# Altium project Metal Detector.PrjPcb
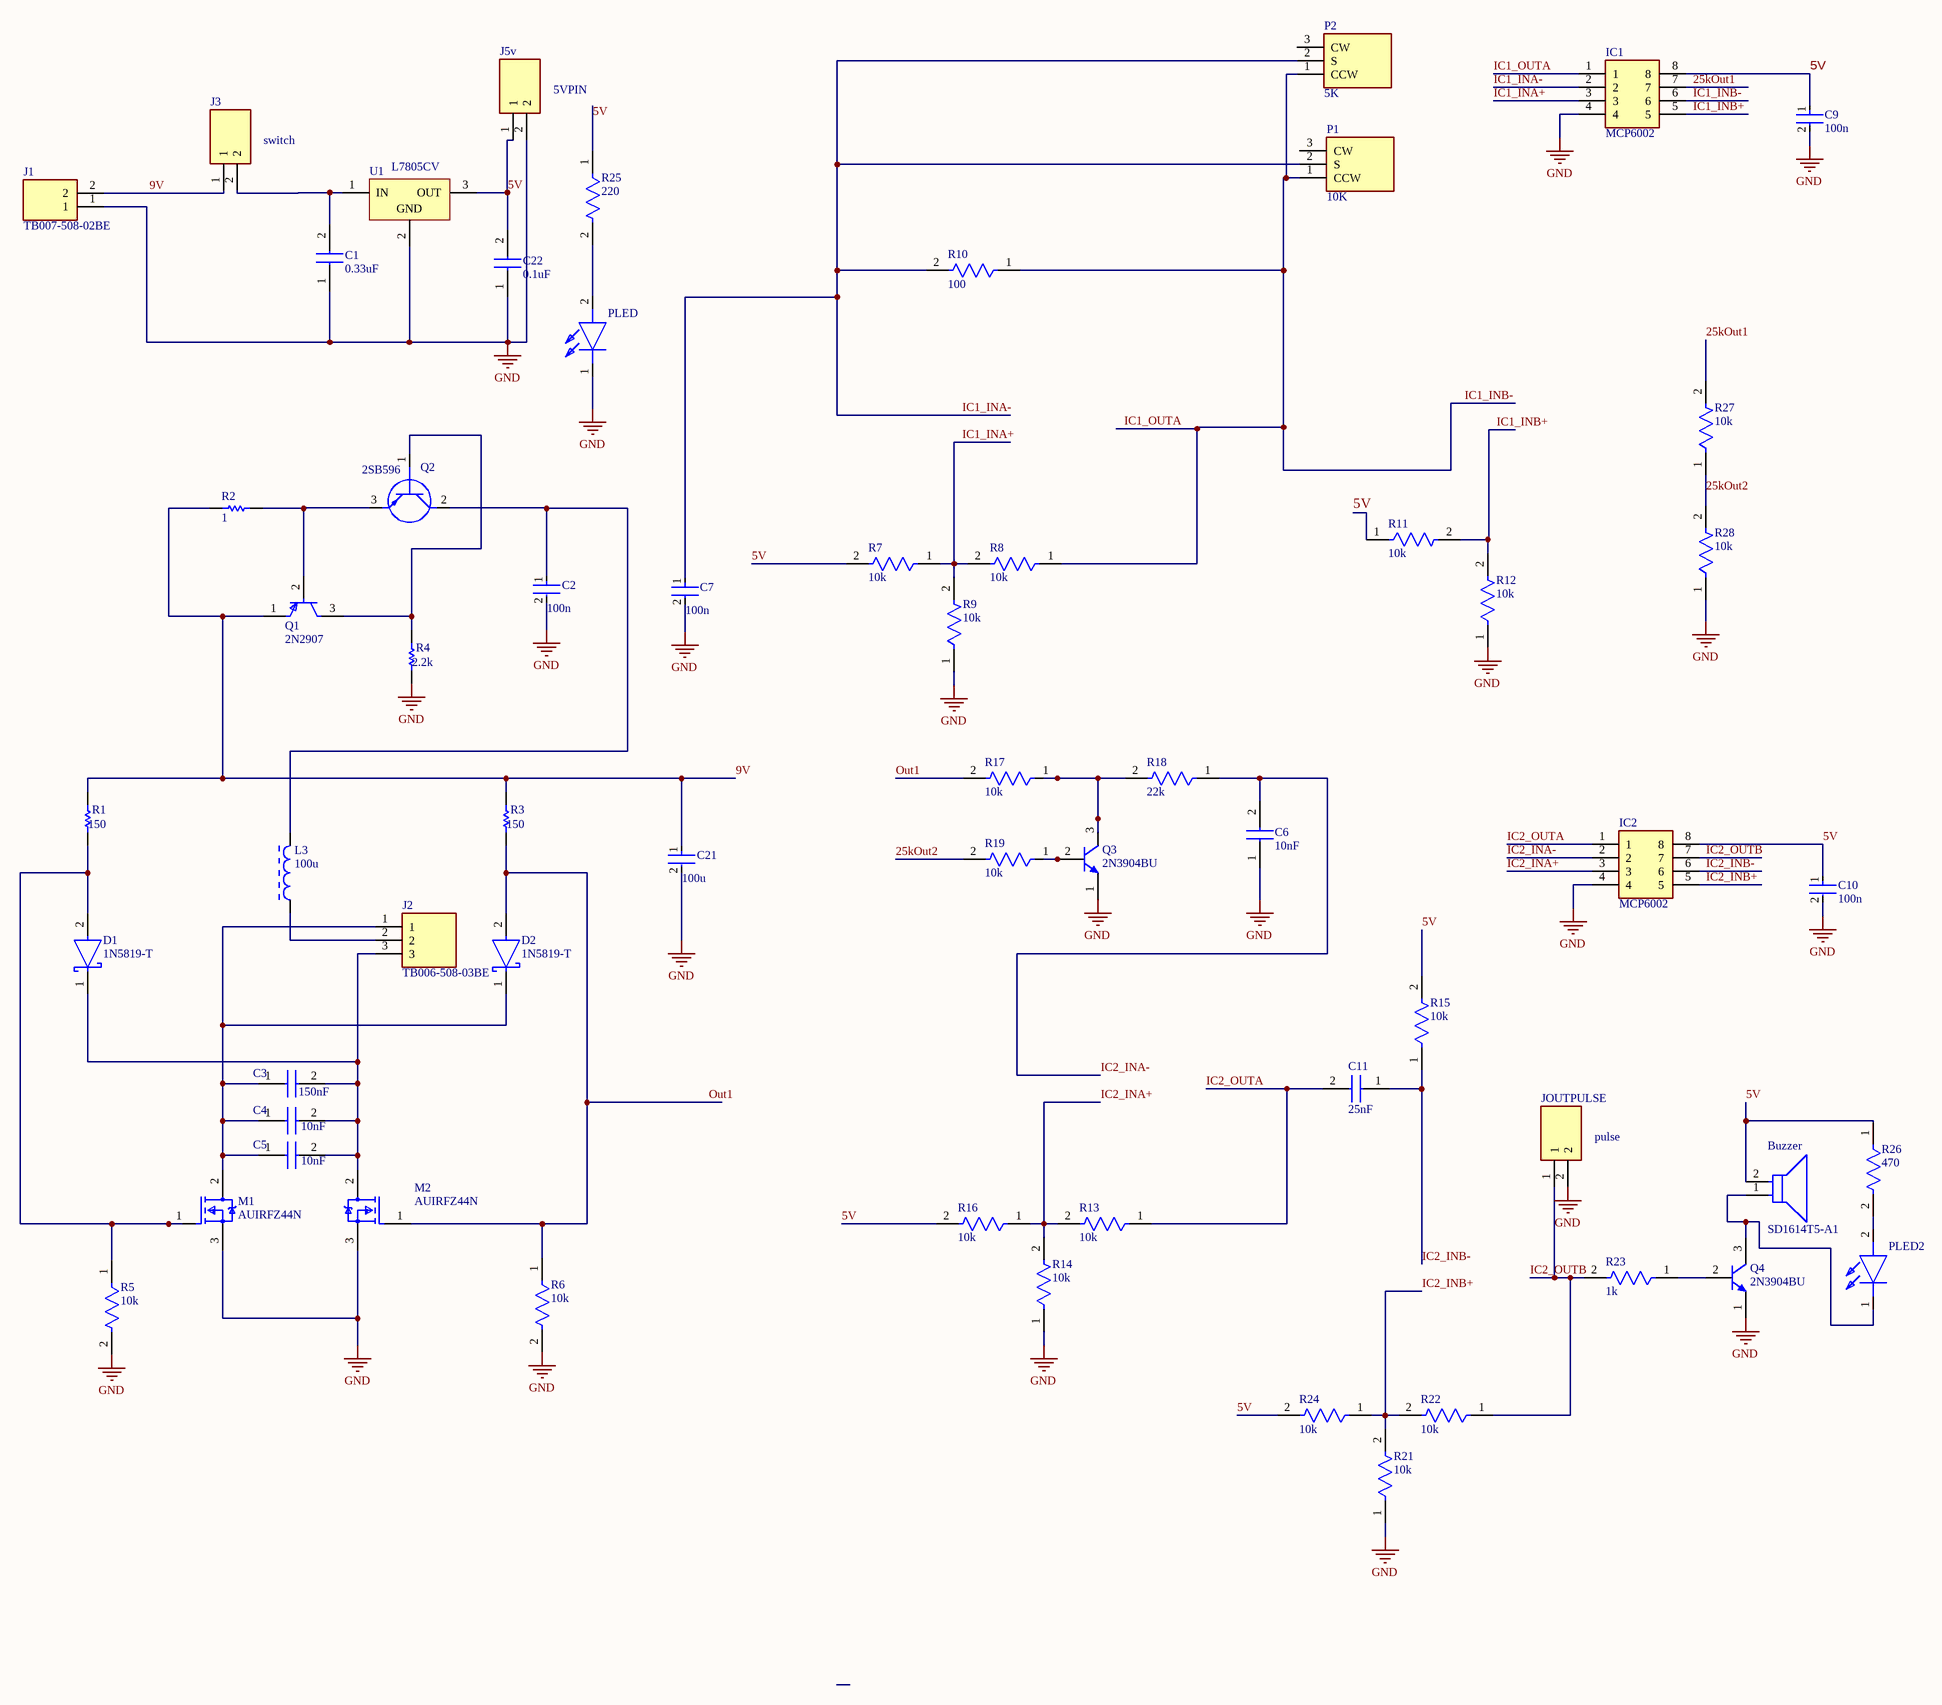
[diagram p0: Sheet1.SchDoc]
1 sheet, 61 parts. Net scope: global (net labels, ports and power ports of the same name join across sheets).
Board file: Metal Detector.PcbDoc

## Sheet Sheet1.SchDoc
size C portrait; SheetNumber: 1; SheetTotal: 1

### Parts
Buzzer  SD1614T5-A1  [FP-SD1614T5-A1-MFG]
C1  0.33uF  [C320C334M5U5TA7301]
C2  100n  [FP-RCE1K1-2_5-MFG]
C3  150nF  [RDER72J154K5E1H03A]
C4  10nF  [C315C103K5R5TA]
C5  10nF  [C315C103K5R5TA]
C6  10nF  [C315C103K5R5TA]
C7  100n  [FP-RCE1K1-2_5-MFG]
C9  100n  [FP-RCE1K1-2_5-MFG]
C10  100n  [FP-RCE1K1-2_5-MFG]
C11  25nF  [C315C103K5R5TA]
C21  100u  [FP-RCE1K1-2_5-MFG]
C22  0.1uF  [FK20]
D1  1N5819-T  [FP-DO-41_Plastic-MFG]
D2  1N5819-T  [FP-DO-41_Plastic-MFG]
IC1  MCP6002  [DIPS762W61P254L1016H525Q8N]
IC2  MCP6002  [DIPS762W61P254L1016H525Q8N]
J1  TB007-508-02BE  [TB00750802BE]
J2  TB006-508-03BE  [TB00650803BE]
J3  switch  [HDRV2W64P0X254_1X2_508X254X864P]
J5v  5VPIN  [HDRV2W64P0X254_1X2_508X254X864P]
JOUTPULSE  pulse  [HDRV2W64P0X254_1X2_508X254X864P]
L3  100u  [BOUR-77F-2_V1]
M1  AUIRFZ44N  [FP-TO-220AB-MFG]
M2  AUIRFZ44N  [FP-TO-220AB-MFG]
P1  10K  [P160KN0QC15B10K]
P2  5K  [P160KN0QC15B10K]
PLED  151051RS11000  [151051RS11000]  (value not drawn)
PLED2  151051RS11000  [151051RS11000]  (value not drawn)
Q1  2N2907  [FP-TO-18-MFG]
Q2  2SB596  [TO254P470X1016X2019-3P]
Q3  2N3904BU  [FAIR-TO-92]
Q4  2N3904BU  [FAIR-TO-92]
R1  150  [RESA60-630X240]
R2  1  [RESA60-630X240]
R3  150  [RESA60-630X240]
R4  2.2k  [RESA60-630X240]
R5  10k  [FP-CF18-MFG]
R6  10k  [FP-CF18-MFG]
R7  10k  [FP-CF18-MFG]
R8  10k  [FP-CF18-MFG]
R9  10k  [FP-CF18-MFG]
R10  100  [FP-CF18-MFG]
R11  10k  [FP-CF18-MFG]
R12  10k  [FP-CF18-MFG]
R13  10k  [FP-CF18-MFG]
R14  10k  [FP-CF18-MFG]
R15  10k  [FP-CF18-MFG]
R16  10k  [FP-CF18-MFG]
R17  10k  [FP-CF18-MFG]
R18  22k  [FP-CF18-MFG]
R19  10k  [FP-CF18-MFG]
R21  10k  [FP-CF18-MFG]
R22  10k  [FP-CF18-MFG]
R23  1k  [FP-CF18-MFG]
R24  10k  [FP-CF18-MFG]
R25  220  [FP-CF18-MFG]
R26  470  [FP-CF18-MFG]
R27  10k  [FP-CF18-MFG]
R28  10k  [FP-CF18-MFG]
U1  L7805CV  [TO220]

### Nets
GND: C1.1 C2.2 C6.1 C7.2 C9.2 C10.2 C21.2 C22.1 IC1.4 IC2.4 J1.1 J5v.2 JOUTPULSE.2 M1.3(S) M2.3(S) PLED.1(K) Q3.1(E) Q4.1(E) R4.1 R5.2 R6.2 R9.1 R12.1 R14.1 R21.1 R28.1 U1.2(GND)
5V: Buzzer.2(A) C9.1 C10.1 C22.2 IC1.8 IC2.8 J5v.1 R7.2 R11.1 R15.2 R16.2 R24.2 R25.1 R26.1 U1.3(OUT)
9V: C21.1 J1.2 J3.1 Q1.1(E) R1.2 R2.1 R3.2
25kOut1: IC1.7 R27.2
25kOut2: R19.2 R27.1 R28.2
IC1_INA+: IC1.3 R7.1 R8.2 R9.2
IC1_INA-: C7.1 IC1.2 P1.2(S) P2.2(S) R10.2
IC1_INB+: IC1.5 R11.2 R12.2
IC1_INB-: IC1.1 IC1.6 P1.1(CCW) P2.1(CCW) R8.1 R10.1  [also labelled IC1_OUTA]
IC2_INA+: IC2.3 R13.2 R14.2 R16.1
IC2_INA-: C6.2 IC2.2 R18.1
IC2_INB+: IC2.5 R21.2 R22.2 R24.1
IC2_INB-: C11.1 IC2.6 R15.1
IC2_OUTA: C11.2 IC2.1 R13.1
IC2_OUTB: IC2.7 JOUTPULSE.1 R22.1 R23.2
Out1: D2.2(A) M2.1(G) R3.1 R6.1 R17.2
NetBuzzer_1: Buzzer.1(C) PLED2.1(K) Q4.3(C)
NetC1_2: C1.2 J3.2 U1.1(IN)
NetC2_1: C2.1 L3.2 Q2.2(C)
NetC3_1: C3.1 C4.1 C5.1 D2.1(C) J2.1 M1.2(D)
NetC3_2: C3.2 C4.2 C5.2 D1.1(C) J2.3 M2.2(D)
NetD1_2: D1.2(A) M1.1(G) R1.1 R5.1
NetJ2_2: J2.2 L3.1
NetPLED2_2: PLED2.2(A) R26.2
NetPLED_2: PLED.2(A) R25.2
NetQ1_2: Q1.2(B) Q2.3(E) R2.2
NetQ1_3: Q1.3(C) Q2.1(B) R4.2
NetQ3_2: Q3.2(B) R19.1
NetQ3_3: Q3.3(C) R17.1 R18.2
NetQ4_2: Q4.2(B) R23.1

Not connected (* = marked no-connect by the designer): P1 3(CW); P2 3(CW)

### Library data of the parts
Buzzer = CMP-08413-000005-1: BUZZER MAGNETIC 5V 80DB 2048HZ 1; Frequency: 2.048kHz; Operating Supply Current: 80mA; Max Operating Temperature: 85°C; Min Operating Temperature: -40°C; Voltage Rating: 5V; Termination: PC Pins; Sensing Method: Magnetic; Mount: Panel
C1 = C320C334M5U5TA7301: Capacitor; Manufacturer_Name: KEMET; Datasheet Link: https://content.kemet.com/datasheets/KEM_C1051_GOLDMAX_Z5U.pdf; Height: 5.84mm; Manufacturer_Part_Number: C320C334M5U5TA7301; Mouser Part Number: 80-C320C334M5U5TATU; Mouser Price/Stock: https://www.mouser.co.uk/ProductDetail/KEMET/C320C334M5U5TA7301?qs=uD%2FdkN7XIa09BDaVzp0DSg%3D%3D
C2 C7 C9 C10 = CMP-06035-028865-1: Cap Ceramic Monolithic 100nF 100V 10% Thru-Hole Bulk; Dielectric: X7R; Lead Diameter: 0.5mm; Lead/Base Style: Formed Leads; Height: 3.5mm; Lead Free: Lead Free; Voltage Rating: 100V; Min Operating Temperature: -55°C; Ratings: AEC-Q200; Voltage Rating (DC): 100V; Termination: Radial; Packaging: Tape and Reel; Package Quantity: 2000; Width: 0.098inch; Case/Package: Radial; Height - Seated (Max): 0.138inch; Capacitance: 100nF; Max Operating Temperature: 125°C; Resistor Type: Ceramic; Lead Pitch: 0.197inch; Tolerance: 10%; Length: 0.157inch; Mount: Through Hole
C3 = RDER72J154K5E1H03A: Capacitor; Manufacturer_Name: Murata Electronics; Datasheet Link: https://search.murata.co.jp/Ceramy/image/img/A01X/G101/ENG/RDE_X7R_250V-1kV_E.pdf; Height: 4mm; Manufacturer_Part_Number: RDER72J154K5E1H03A; Mouser Part Number: 81-RDER72J154K5E1H3A; Mouser Price/Stock: https://www.mouser.co.uk/ProductDetail/Murata-Electronics/RDER72J154K5E1H03A?qs=hNud%2FORuBR3iiULarVQtcw%3D%3D; Arrow Part Number: RDER72J154K5E1H03A; Arrow Price/Stock: https://www.arrow.com/en/products/rder72j154k5e1h03a/murata-manufacturing
C4-C6 C11 = C315C103K5R5TA: Capacitor; Manufacturer_Name: KEMET; Datasheet Link: https://content.kemet.com/datasheets/KEM_C1050_GOLDMAX_X7R.pdf; Height: 4.66mm; Manufacturer_Part_Number: C315C103K5R5TA; Mouser Part Number: 80-C315C103K5R; Mouser Price/Stock: https://www.mouser.co.uk/ProductDetail/KEMET/C315C103K5R5TA?qs=73D%2FyAt1UYt79hsndjhLPg%3D%3D; Arrow Part Number: C315C103K5R5TA; Arrow Price/Stock: https://www.arrow.com/en/products/c315c103k5r5ta/kemet-corporation?utm_currency=USD&region=nac
C21 = CMP-06035-028865-1: Cap Ceramic Monolithic 100nF 100V 10% Thru-Hole Bulk; Dielectric: X7R; Lead Diameter: 0.5mm; Capacitance: 100uF; Lead/Base Style: Formed Leads; Height: 3.5mm; Lead Free: Lead Free; Voltage Rating: 100V; Min Operating Temperature: -55°C; Ratings: AEC-Q200; Voltage Rating (DC): 100V; Termination: Radial; Packaging: Tape and Reel; Package Quantity: 2000; Width: 0.098inch; Case/Package: Radial; Height - Seated (Max): 0.138inch; Max Operating Temperature: 125°C; Resistor Type: Ceramic; Lead Pitch: 0.197inch; Tolerance: 10%; Length: 0.157inch; Mount: Through Hole
C22 = FK20C0G1H104JN000: Capacitor; Manufacturer_Name: TDK; Datasheet Link: https://product.tdk.com/system/files/dam/doc/product/capacitor/ceramic/lead-mlcc/catalog/leadmlcc_conventional_fk_en.pdf; Height: 7mm; Manufacturer_Part_Number: FK20C0G1H104JN000
D1 D2 = CMP-12790-000042-1: DIODE SCHOTTKY 40V 1A DO41; Manufacturer: Diodes Inc.; Max Surge Forward Current: 25A; Capacitance: 110 pF; Max Junction Temp: +125°C; Peak Reverse Current: 1mA; Value: 110 pF; Temperature Range Low: -65°C; Footprint Url: https://www.diodes.com/assets/Package-Files/DO-41-Plastic.pdf; Digikey Description: DIODE SCHOTTKY 40V 1A DO41; Category: Diode; Mouser Description: Schottky Diodes & Rectifiers Vr/40V Io/1A T/R; Device Class L2: Diodes; Temperature Range High: +125°C; RoHS: TRUE; Device Class L3: Schottky Diodes; ComponentLink2Description: Datasheet; Temperature: -65°C to +125°C; Reverse Voltage: 40V; Height: 2.72mm; ComponentLink2URL: https://www.diodes.com/assets/Datasheets/ds23001.pdf; Forward Current: 1A; Manufacturer Part Number: 1N5819-T; Lead Free: Yes; Device Class L1: Discrete Semiconductors; Max Repetitive Reverse Voltage: 40V; Ipc Land Pattern Name: DIOPA1091W105L521D272; Automotive: No; Package: DO-41 (Plastic); Octopart: https://octopart.com/1n5819-t-diodes+inc.-55389586
IC1 IC2 = A_08-LC-TT: Connector; Manufacturer_Name: ASSMANN WSW components GmbH; Manufacturer_Part_Number: A 08-LC-TT; Datasheet Link: http://www.assmann-wsw.com/fileadmin/datasheets/ASS_0810_CO.pdf; Height: 5.25mm; Arrow Part Number: A 08-LC-TT; Arrow Price/Stock: https://www.arrow.com/en/products/a08-lc-tt/assmann-wsw-components-inc?region=nac
J1 = TB007-508-02BE: Connector; Manufacturer_Name: Same Sky; Datasheet Link: https://www.digikey.ph/en/products/detail/same-sky-formerly-cui-devices/TB007-508-02BE/10064127?msockid=3bdc366bbe0663d83c1223c0bf3662a6; Height: 14mm; Manufacturer_Part_Number: TB007-508-02BE; Mouser Part Number: 490-TB007-508-02BE; Mouser Price/Stock: https://www.mouser.co.uk/ProductDetail/Same-Sky/TB007-508-02BE?qs=vLWxofP3U2y6PFKAfCqKUQ%3D%3D; Arrow Part Number: TB007-508-02BE; Arrow Price/Stock: https://www.arrow.com/en/products/tb007-508-02be/cui-devices?utm_currency=USD&region=nac
J2 = TB006-508-03BE: Connector; Manufacturer_Name: Same Sky; Datasheet Link: https://www.sameskydevices.com/product/resource/supplyframepdf/tb006-508.pdf; Height: 10.4mm; Manufacturer_Part_Number: TB006-508-03BE; Mouser Part Number: 490-TB006-508-03BE; Mouser Price/Stock: https://www.mouser.co.uk/ProductDetail/Same-Sky/TB006-508-03BE?qs=vLWxofP3U2zmvvLYJBQLMA%3D%3D; Arrow Part Number: TB006-508-03BE; Arrow Price/Stock: https://www.arrow.com/en/products/tb006-508-03be/cui-devices?utm_currency=USD&region=nac
J3 J5v JOUTPULSE = M20-9990245: Connector; Manufacturer_Name: Harwin; Datasheet Link: https://cdn.harwin.com/pdfs/M20-999.pdf; Height: 8.64mm; Manufacturer_Part_Number: M20-9990245; Mouser Part Number: 855-M20-9990245; Mouser Price/Stock: https://www.mouser.co.uk/ProductDetail/Harwin/M20-9990245?qs=Jph8NoUxIfUDXEB%252Bi9kJRA%3D%3D
L3 = CMP-0732-00001-1: 77F Series Conformal Coated RF Choke, 470 uH +/- 5%, 126 mA, -55 to 105 degC, 3.99 mm Dia x 10.4 mm Length, RoHS, Tape and Reel; PartNumber: 77F471J-TR-RC; Manufacturer: Bourns; Inductance 100 kHz (Tol. %): 100 uH +/- 5; SRF Min.(MHz): 1.8; RDC Max.(Ohm): 8.5; Idc (mA): 126; Test Frequency (MHz): 0.796; Q Min.: 50; ComponentLink2Description: Datasheet; PackageReference: 77F-2; ComponentLink3Description: Package Specification; ComponentLink1URL: http://www.bourns.com/; ComponentLink2URL: http://www.bourns.com/data/global/pdfs/77F_series.pdf; Operating Temperature: -55 to 105 degC; Packing: Tape and Reel; PackageDescription: 2-Pin Through Hole RF Choke , Dia 3.99 mm, Length 10.4 mm; PackageVersion: Rev. 10/12; ComponentLink1Description: Manufacturer URL; ComponentLink3URL: http://www.bourns.com/data/global/pdfs/77F_series.pdf; RoHS: TRUE; DatasheetVersion: Rev. 10/12; Mounting Technology: Through Hole
M1 M2 = CMP-00196-65872631-1: AUIRFZ44N Automotive Q101 55V Single N-Channel HEXFET Power MOSFET in a TO-220AB Package, TO220-3, RoHS; Turn-On Delay Time: 7.3ns; Continuous Drain Current (ID): 49A; Max Power Dissipation: 94W; Fall Time: 60ns; On-State Resistance: 17.5mΩ; Number of Elements: 1; Turn-Off Delay Time: 44ns; Input Capacitance: 1.47nF; Threshold Voltage: 2V; Gate to Source Voltage (Vgs): 20V; Rise Time: 69ns; Max Junction Temperature (Tj): 175°C; Height: 16.51mm; Number of Pins: 3; Drain to Source Voltage (Vdss): 55V; Width: 4.82mm; Length: 10.66mm; NexarPartId: 65872631; REACH SVHC: No SVHC; Mount: Surface Mount, Through Hole; Contact Plating: Tin; Case/Package: TO-220AB; Package Quantity: 1000; Radiation Hardening: No; Power Dissipation: 94W; Element Configuration: Single; Schedule B: 8541290080, 8541290080; RoHS: Compliant; Lifecycle Status: Obsolete; Number of Channels: 1; Drain to Source Breakdown Voltage: 55V; Max Operating Temperature: 175°C; Rds On Max: 17.5mΩ; Drain to Source Resistance: 17.5mΩ; Min Operating Temperature: -55°C
P1 P2 = P160KN-0QC15B10K: Variable Resistor; Manufacturer_Name: TT Electronics; Datasheet Link: https://www.ttelectronics.com/TTElectronics/media/ProductFiles/Potentiometers/Datasheets/P160.pdf; Height: 16.5mm; Manufacturer_Part_Number: P160KN-0QC15B10K; Mouser Part Number: 858-P160KN-0QC15B10K; Mouser Price/Stock: https://www.mouser.co.uk/ProductDetail/BI-Technologies-TT-Electronics/P160KN-0QC15B10K?qs=%252BUYXD5bnyXowj%252Bd8P32cNw%3D%3D; Arrow Part Number: P160KN-0QC15B10K; Arrow Price/Stock: https://www.arrow.com/en/products/p160kn-0qc15b10k/bi-technologies
PLED PLED2 = 151051RS11000: LED; Manufacturer_Name: Wurth Elektronik; Datasheet Link: https://katalog.we-online.com/led/datasheet/151051RS11000.pdf; Height: 13.6mm; Manufacturer_Part_Number: 151051RS11000; Mouser Part Number: 710-151051RS11000; Mouser Price/Stock: https://www.mouser.co.uk/ProductDetail/Wurth-Elektronik/151051RS11000?qs=LlUlMxKIyB0NuMCRBgVmEg%3D%3D
Q1 = CMP-00252-117134470-1: 2N2907 Small-Signal Bjt To-18 Rohs Compliant: Yes; Power Dissipation: 500mW; Number of Elements: 1; Collector Emitter Saturation Voltage: 1.6V; Max Junction Temperature (Tj): 200°C; Collector Emitter Voltage (VCEO): 60V; Max Collector Current: 600mA; hFE Min: 100; Emitter Base Voltage (VEBO): 5V; Height: 5.33mm; Max Operating Temperature: 200°C; NexarPartId: 117134470; Case/Package: TO-18; Lifecycle Status: Production; Collector Base Voltage (VCBO): 60V; Collector Emitter Breakdown Voltage: 60V; Min Operating Temperature: -65°C
Q2 = TIP42C: Transistor BJT PNP; Manufacturer_Name: onsemi; Datasheet Link: http://www.mouser.com/ds/2/149/TIP42C-890174.pdf; Height: 4.7mm; Manufacturer_Part_Number: TIP42C; Mouser Part Number: 512-TIP42C; Mouser Price/Stock: https://www.mouser.co.uk/ProductDetail/onsemi-Fairchild/TIP42C?qs=cnIeywgme7b7B3r0xPyyBQ%3D%3D; Arrow Part Number: TIP42C; Arrow Price/Stock: https://www.arrow.com/en/products/tip42c/on-semiconductor
Q3 Q4 = CMP-2000-04944-1: NPN General-Purpose Amplifier, 40 V VCEO, 0.2 A, -55 to 150 degC, 2-Pin TO-92, RoHS, Bulk; Manufacturer: FairchildSemiconductor; Maximum Collector Base Voltage: 60V; Minimum DC Current Gain: 40@0.1mA@1V; Maximum Collector Emitter Voltage: 40V; Maximum DC Collector Current: 0.2A; Rad Hard: No; Maximum Operating Frequency: 300(Min)MHz; Maximum Collector Emitter Saturation Voltage: 0.2@1mA@10mA; Maximum Power Dissipation: 625mW; Package Description: 3-Pin Transistor Outline Package, Body Dia 4.79 mm, Pitch 1.27 mm; Package Reference: TO-92; Pin Count: 3; Operating Temperature: -55to150degC; Category: GPBJT; Manufacturer URL: https://www.fairchildsemi.com/; Datasheet URL: https://datasheet.ciiva.com/4722/2n3904-82270-4722369.pdf; Package: 3TO-92; Packaging: Bulk; Type: NPN; Datasheet Version: Rev. 1.1.0, 10/2014; Mounting: ThroughHole
R1 R3 = CMP-1659-00075-1: Axial Resistor, 1 KOhm, +/- 1%, 250 mW, -55 to 155 degC, 2-Pin THD, RoHS, Bulk; Voltage Rating: 250 V; Resistance: 150 ohm; Power Rating: 250 mW; ComponentLink2Description: Datasheet; RoHSCompliant: true; PackageReference: MFR-25; Case\Package: Axial; Max Operating Temperature: 155 degC; DatasheetVersion: Apr-13; Tolerance: 1%; ComponentLink1URL: http://www.yageo.com/; Length: 0.248 inch; ComponentLink2URL: http://www.yageo.com/documents/recent/Yageo%20LR_MFR_2013.pdf; Packaging: Bulk; Package Quantity: 200; PackageDescription: 2-Pin Axial Lead, Dia 2.4 mm, Body Length 6.3 mm; Min Operating Temperature: -55 degC; ComponentLink1Description: Manufacturer URL
R2 = CMP-1659-00075-1: Axial Resistor, 1 KOhm, +/- 1%, 250 mW, -55 to 155 degC, 2-Pin THD, RoHS, Bulk; Voltage Rating: 250 V; Resistance: 1 ohm; Power Rating: 250 mW; ComponentLink2Description: Datasheet; RoHSCompliant: true; PackageReference: MFR-25; Case\Package: Axial; Max Operating Temperature: 155 degC; DatasheetVersion: Apr-13; Tolerance: 1%; ComponentLink1URL: http://www.yageo.com/; Length: 0.248 inch; ComponentLink2URL: http://www.yageo.com/documents/recent/Yageo%20LR_MFR_2013.pdf; Packaging: Bulk; Package Quantity: 200; PackageDescription: 2-Pin Axial Lead, Dia 2.4 mm, Body Length 6.3 mm; Min Operating Temperature: -55 degC; ComponentLink1Description: Manufacturer URL
R4 = CMP-1659-00075-1: Axial Resistor, 1 KOhm, +/- 1%, 250 mW, -55 to 155 degC, 2-Pin THD, RoHS, Bulk; Voltage Rating: 250 V; Resistance: 2200 ohm; Power Rating: 250 mW; ComponentLink2Description: Datasheet; RoHSCompliant: true; PackageReference: MFR-25; Case\Package: Axial; Max Operating Temperature: 155 degC; DatasheetVersion: Apr-13; Tolerance: 1%; ComponentLink1URL: http://www.yageo.com/; Length: 0.248 inch; ComponentLink2URL: http://www.yageo.com/documents/recent/Yageo%20LR_MFR_2013.pdf; Packaging: Bulk; Package Quantity: 200; PackageDescription: 2-Pin Axial Lead, Dia 2.4 mm, Body Length 6.3 mm; Min Operating Temperature: -55 degC; ComponentLink1Description: Manufacturer URL
R5-R17 R19 R21 R22 R24 R25 R27 R28 = CMP-26528-000002-1: RES 10K OHM 1/8W 5% CF AXIAL; Manufacturer Part Number: CF18JT10K0; Manufacturer: Stackpole Electronics; Power Rating: 0.125W; Temperature Coefficient: 0-500ppm/°C; Resistance: 10kΩ; Voltage Rating: 250V; Value: 10kΩ; Temperature: -55°C to +155°C; Height: 2mm; Lead Free: Yes; Automotive: No; Device Class L2: Resistors; Package: CF18; Series: CF; ComponentLink2Description: Datasheet; Ipc Land Pattern Name: RESAD656W65L360D200; Temperature Range High: +155°C; RoHS: TRUE; Device Class L3: Through-Hole Resistors; Temperature Range Low: -55°C; Device Class L1: Passive Components; Category: Res; Octopart: https://octopart.com/cf18jt10k0-stackpole+electronics-19205642; Composition: Carbon Film; Digikey Description: RES 10K OHM 1/8W 5% CF AXIAL; ComponentLink2URL: http://www.seielect.com/Catalog/SEI-CF_CFM.pdf; Tolerance: 5%
R18 = CMP-26528-000002-1: RES 10K OHM 1/8W 5% CF AXIAL; Manufacturer Part Number: CF18JT10K0; Manufacturer: Stackpole Electronics; Power Rating: 0.125W; Temperature Coefficient: 0-500ppm/°C; Resistance: 22kΩ; Voltage Rating: 250V; Value: 22kΩ; Temperature: -55°C to +155°C; Height: 2mm; Lead Free: Yes; Automotive: No; Device Class L2: Resistors; Package: CF18; Series: CF; ComponentLink2Description: Datasheet; Ipc Land Pattern Name: RESAD656W65L360D200; Temperature Range High: +155°C; RoHS: TRUE; Device Class L3: Through-Hole Resistors; Temperature Range Low: -55°C; Device Class L1: Passive Components; Category: Res; Octopart: https://octopart.com/cf18jt10k0-stackpole+electronics-19205642; Composition: Carbon Film; Digikey Description: RES 10K OHM 1/8W 5% CF AXIAL; ComponentLink2URL: http://www.seielect.com/Catalog/SEI-CF_CFM.pdf; Tolerance: 5%
R23 R26 = CMP-26528-000002-1: RES 10K OHM 1/8W 5% CF AXIAL; Manufacturer Part Number: CF18JT10K0; Manufacturer: Stackpole Electronics; Power Rating: 0.125W; Temperature Coefficient: 0-500ppm/°C; Resistance: 1kΩ; Voltage Rating: 250V; Value: 1kΩ; Temperature: -55°C to +155°C; Height: 2mm; Lead Free: Yes; Automotive: No; Device Class L2: Resistors; Package: CF18; Series: CF; ComponentLink2Description: Datasheet; Ipc Land Pattern Name: RESAD656W65L360D200; Temperature Range High: +155°C; RoHS: TRUE; Device Class L3: Through-Hole Resistors; Temperature Range Low: -55°C; Device Class L1: Passive Components; Category: Res; Octopart: https://octopart.com/cf18jt10k0-stackpole+electronics-19205642; Composition: Carbon Film; Digikey Description: RES 10K OHM 1/8W 5% CF AXIAL; ComponentLink2URL: http://www.seielect.com/Catalog/SEI-CF_CFM.pdf; Tolerance: 5%
U1 = CMP-0244-00483-1: Positive Voltage Regulator, 5V, 3-Pin TO-220; PackageDescription: TO, Thru-Hole, Vertical, Heatsink Mounted; 3 In-Line Leads; Pitch 2.54 mm; ComponentLink2Description: Datasheet; PackageReference: TO220; ComponentLink3URL: http://www.st.com/internet/com/TECHNICAL_RESOURCES/TECHNICAL_LITERATURE/PACKAGE_INFORMATION/CD00004649.pdf; DatasheetVersion: 16/11/2011; ComponentLink1Description: Manufacturer URL; ComponentLink1URL: http://www.st.com; PackageVersion: ver3.0; ComponentLink3Description: Package Specification; ComponentLink2URL: http://www.st.com/internet/com/TECHNICAL_RESOURCES/TECHNICAL_LITERATURE/DATASHEET/CD00000444.pdf